# Altium schematic sheet STM32405RG.SchDoc
size A
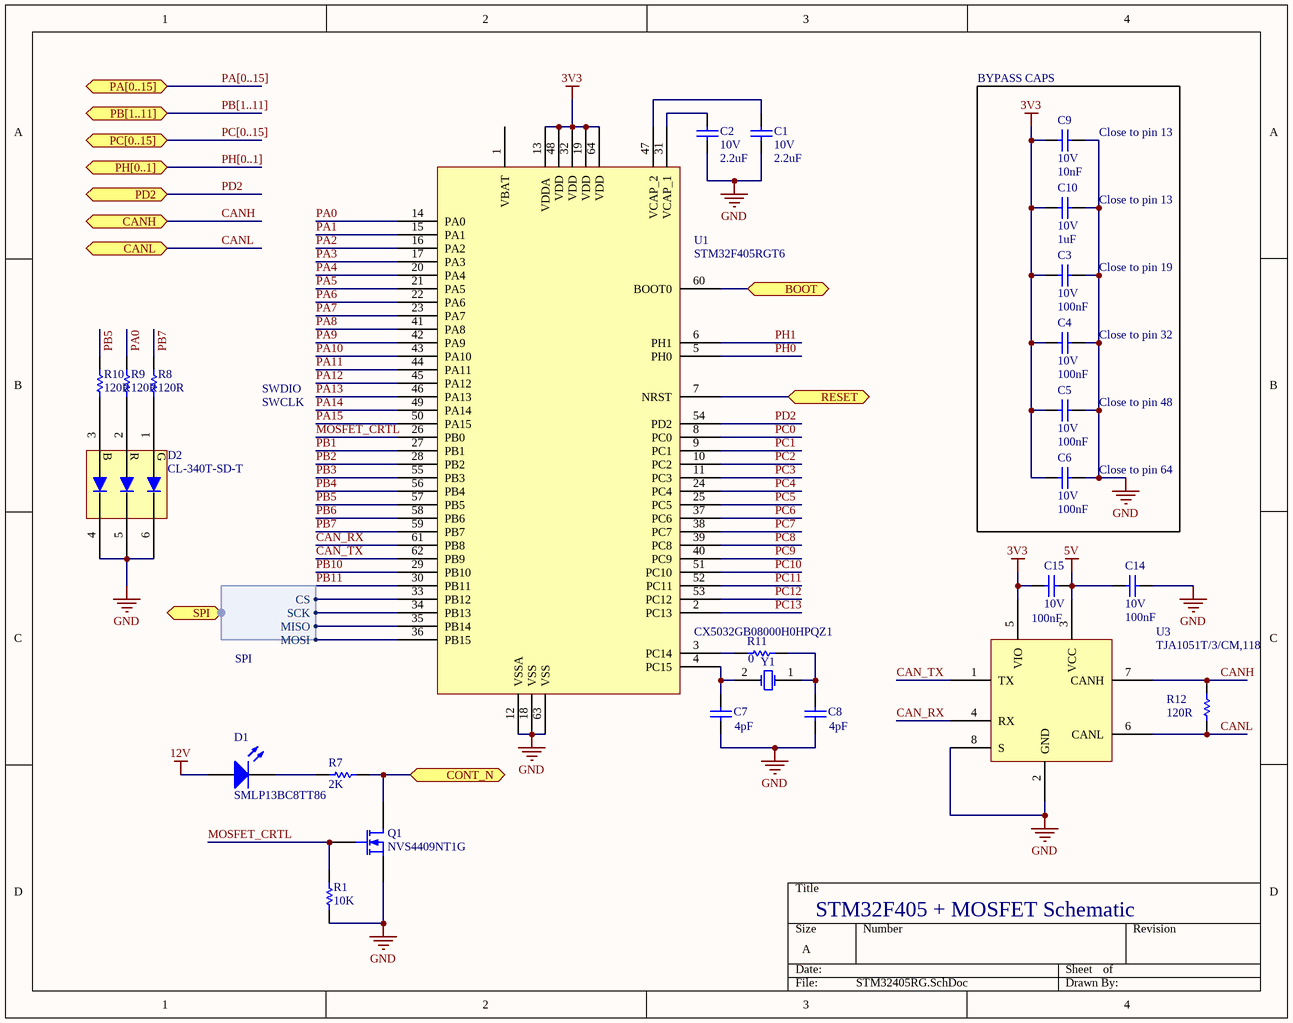
[diagram p0: STM32405RG.SchDoc]

## Parts
C1  10V  value 2.2uF  [C0805]
C2  10V  value 2.2uF  [C0805]
C3  10V  value 100nF  [C0805]
C4  10V  value 100nF  [C0805]
C5  10V  value 100nF  [C0805]
C6  10V  value 100nF  [C0805]
C7  value 4pF  [C0805]  (hidden comment: 50V)
C8  value 4pF  [C0805]  (hidden comment: 50V)
C9  10V  value 10nF  [C0805]
C10  10V  value 1uF  [C0805]
C14  10V  value 100nF  [C0805]
C15  10V  value 100nF  [C0805]
D1  SMLP13BC8TT86  [SMLP13BC8TT86]
D2  CL-340T-SD-T  [CL-340T-SD-T]
Q1  NVS4409NT1G  [NVS4409NT1G]
R1  value 10K  [J1-0603]  (hidden comment: 5%)
R7  value 2K  [J1-0603]  (hidden comment: 5%)
R8  value 120R  [J1-0603]  (hidden comment: 1%)
R9  value 120R  [J1-0603]  (hidden comment: 1%)
R10  value 120R  [J1-0603]  (hidden comment: 1%)
R11  value 0  [J1-0603]  (hidden comment: 0603)
R12  value 120R  [J1-0603]  (hidden comment: 1%)
U1  STM32F405RGT6  [STM32F405RGT6TR]
U3  TJA1051T/3/CM,118
Y1  CX5032GB08000H0HPQZ1  [CX5032GB08000H0HPQZ1]

## Ports
BOOT (bidir), CANH (bidir), CANL (bidir), CONT_N (bidir), PA[0..15] (bidir), PB[1..11] (bidir), PC[0..15] (bidir), PD2 (bidir), PH[0..1] (bidir), RESET (bidir), SPI (bidir, harness SPI)

## Harnesses
SPI: CS, SCK, MISO, MOSI

## Nets
3V3: C3.1 C4.1 C5.1 C6.1 C9.1 C10.2 C15.1 U1.13(VDDA) U1.19(VDD) U1.32(VDD) U1.48(VDD) U1.64(VDD) U3.5(VIO)
5V: C14.1 C15.2 U3.3(VCC)
12V: D1.1(A)
GND: C1.1 C2.1 C3.2 C4.2 C5.2 C6.2 C7.1 C8.1 C9.2 C10.1 C14.2 D2.4 D2.5 D2.6 Q1.3(S) R1.1 U1.12(VSSA) U1.18(VSS) U1.63(VSS) U3.2(GND) U3.8(S)
BOOT: U1.60(BOOT0) ; port BOOT
CAN_RX: U1.61(PB8) U3.4(RX)
CAN_TX: U1.62(PB9) U3.1(TX)
CANH: R12.2 U3.7(CANH) ; port CANH
CANL: R12.1 U3.6(CANL) ; port CANL
CONT_N: Q1.1(D) R7.1 ; port CONT_N
MOSFET_CRTL: Q1.2(G) R1.2 U1.26(PB0)
PA0: R9.2 U1.14(PA0)
PA1: U1.15(PA1)
PA2: U1.16(PA2)
PA3: U1.17(PA3)
PA4: U1.20(PA4)
PA5: U1.21(PA5)
PA6: U1.22(PA6)
PA7: U1.23(PA7)
PA8: U1.41(PA8)
PA9: U1.42(PA9)
PA10: U1.43(PA10)
PA11: U1.44(PA11)
PA12: U1.45(PA12)
PA13: U1.46(PA13)
PA14: U1.49(PA14)
PA15: U1.50(PA15)
PB1: U1.27(PB1)
PB2: U1.28(PB2)
PB3: U1.55(PB3)
PB4: U1.56(PB4)
PB5: R10.2 U1.57(PB5)
PB6: U1.58(PB6)
PB7: R8.2 U1.59(PB7)
PB10: U1.29(PB10)
PB11: U1.30(PB11)
PC0: U1.8(PC0)
PC1: U1.9(PC1)
PC2: U1.10(PC2)
PC3: U1.11(PC3)
PC4: U1.24(PC4)
PC5: U1.25(PC5)
PC6: U1.37(PC6)
PC7: U1.38(PC7)
PC8: U1.39(PC8)
PC9: U1.40(PC9)
PC10: U1.51(PC10)
PC11: U1.52(PC11)
PC12: U1.53(PC12)
PC13: U1.2(PC13)
PD2: U1.54(PD2) ; port PD2
PH0: U1.5(PH0)
PH1: U1.6(PH1)
RESET: U1.7(NRST) ; port RESET
NetC1_2: C1.2 U1.47(VCAP_2)
NetC2_2: C2.2 U1.31(VCAP_1)
NetC7_2: C7.2 U1.4(PC15) Y1.2(OSC2)
NetC8_2: C8.2 R11.2 Y1.1(OSC1)
NetD1_2: D1.2(K) R7.2
NetD2_1: D2.1 R8.1
NetD2_2: D2.2 R9.1
NetD2_3: D2.3 R10.1
NetR11_1: R11.1 U1.3(PC14)
NetU1_33: U1.33(PB12) ; port SPI.CS
NetU1_34: U1.34(PB13) ; port SPI.SCK
NetU1_35: U1.35(PB14) ; port SPI.MISO
NetU1_36: U1.36(PB15) ; port SPI.MOSI

Not connected (* = marked no-connect by the designer): U1 1(VBAT)

## Buses and harness runs
bus PA[0..15] = port PA[0..15]
bus PB[1..11] = port PB[1..11]
bus PC[0..15] = port PC[0..15]
bus PH[0..1] = port PH[0..1]

## Notes on the sheet
- BYPASS CAPS
- (near C9) Close to pin 13
- (near C10) Close to pin 13
- (near C3) Close to pin 19
- (near C4) Close to pin 32
- SWCLK
- SWDIO
- (near C5) Close to pin 48
- (near C6) Close to pin 64
- STM32F405 + MOSFET Schematic
- (in symbol CL-340T-SD-T) B; R; G

## Library data of the parts
C1 C2 = Cap: C0805C225K8RACAUTO. 2.2µF ±10% 10V Ceramic Capacitor X7R 0805 (2012 Metric) /; Published: 8-Jun-2000; LatestRevisionDate: 17-Jul-2002; LatestRevisionNote: Re-released for DXP Platform.; PackageReference: RAD-0.3; Publisher: Altium Limited; PackageDescription: Radial Cap, Thru-Hole; 2 Leads; 0.3 in Pin Spacing
C3-C6 C14 C15 = Cap: C0805C104K8RACTU. 0.1µF ±10% 10V Ceramic Capacitor X7R 0805 (2012 Metric) /; Published: 8-Jun-2000; LatestRevisionDate: 17-Jul-2002; LatestRevisionNote: Re-released for DXP Platform.; PackageReference: RAD-0.3; Publisher: Altium Limited; PackageDescription: Radial Cap, Thru-Hole; 2 Leads; 0.3 in Pin Spacing
C7 = Cap: CBR08C409B5GAC. 4pF ±0.1pF 50V Ceramic Capacitor C0G, NP0 0805 (2012 Metric); Published: 8-Jun-2000; LatestRevisionDate: 17-Jul-2002; LatestRevisionNote: Re-released for DXP Platform.; PackageReference: RAD-0.3; Publisher: Altium Limited; PackageDescription: Radial Cap, Thru-Hole; 2 Leads; 0.3 in Pin Spacing
C8 = Cap: CBR08C409B5GAC; Published: 8-Jun-2000; LatestRevisionDate: 17-Jul-2002; LatestRevisionNote: Re-released for DXP Platform.; PackageReference: RAD-0.3; Publisher: Altium Limited; PackageDescription: Radial Cap, Thru-Hole; 2 Leads; 0.3 in Pin Spacing
C9 = Cap: C0805C103K8RAC7800. 10000pF ±10% 10V Ceramic Capacitor X7R 0805 (2012 Metric) /; Published: 8-Jun-2000; LatestRevisionDate: 17-Jul-2002; LatestRevisionNote: Re-released for DXP Platform.; PackageReference: RAD-0.3; Publisher: Altium Limited; PackageDescription: Radial Cap, Thru-Hole; 2 Leads; 0.3 in Pin Spacing
C10 = Cap: CL21B105KPFNNNE. 1µF ±10% 10V Ceramic Capacitor X7R 0805 (2012 Metric) /; Published: 8-Jun-2000; LatestRevisionDate: 17-Jul-2002; LatestRevisionNote: Re-released for DXP Platform.; PackageReference: RAD-0.3; Publisher: Altium Limited; PackageDescription: Radial Cap, Thru-Hole; 2 Leads; 0.3 in Pin Spacing
D1 = LED2: Blue 470nm LED Indication - Discrete 2.9V 2-SMD, No Lead; Published: 8-Jun-2000; LatestRevisionDate: 17-Jul-2002; LatestRevisionNote: Re-released for DXP Platform.; PackageVersion: Feb-2002; PackageReference: 3.2X1.6X1.1; Publisher: Altium Limited; PackageDescription: SM LED; 2 Flat Leads
Q1 = MOSFET-N: N-Channel 25V 700mA (Ta) 280mW (Tj) Surface Mount SC-70-3 (SOT323); Published: 8-Jun-2000; LatestRevisionDate: 17-Jul-2002; LatestRevisionNote: Re-released for DXP Platform.; PackageVersion: 1995/1996; PackageReference: E3; Publisher: Altium Limited; PackageDescription: TO, Flat Index; 3 In-Line, Axial Leads; Body Dia. 4.6mm; Lead Dia. 0.5 mm (max)
R1 = Res1: ERJ-3GEYJ103V. 10 kOhms ±5% 0.1W, 1/10W Chip Resistor 0603 (1608 Metric) Automotive AEC-Q200 Thick Film /; Published: 8-Jun-2000; LatestRevisionDate: 17-Jul-2002; LatestRevisionNote: Re-released for DXP Platform.; PackageReference: AXIAL-0.3; Publisher: Altium Limited; PackageDescription: Axial Device, Thru-Hole; 2 Leads; 0.3 in Pin Spacing
R7 = Res1: ERJ-PA3J202V. 2 kOhms ±5% 0.25W, 1/4W Chip Resistor 0603 (1608 Metric) Automotive AEC-Q200, Pulse Withstanding Thick Film /; Published: 8-Jun-2000; LatestRevisionDate: 17-Jul-2002; LatestRevisionNote: Re-released for DXP Platform.; PackageReference: AXIAL-0.3; Publisher: Altium Limited; PackageDescription: Axial Device, Thru-Hole; 2 Leads; 0.3 in Pin Spacing
R8-R10 R12 = Res1: RC0603FR-07120RL. 120 Ohms ±1% 0.1W, 1/10W Chip Resistor 0603 (1608 Metric) Moisture Resistant Thick Film /; Published: 8-Jun-2000; LatestRevisionDate: 17-Jul-2002; LatestRevisionNote: Re-released for DXP Platform.; PackageReference: AXIAL-0.3; Publisher: Altium Limited; PackageDescription: Axial Device, Thru-Hole; 2 Leads; 0.3 in Pin Spacing
R11 = Res1: ERJ-U030R00V. 0 Ohms Jumper 0.1W, 1/10W Chip Resistor 0603 (1608 Metric) Anti-Sulfur, Automotive AEC-Q200 Thick Film; Published: 8-Jun-2000; LatestRevisionDate: 17-Jul-2002; LatestRevisionNote: Re-released for DXP Platform.; PackageReference: AXIAL-0.3; Publisher: Altium Limited; PackageDescription: Axial Device, Thru-Hole; 2 Leads; 0.3 in Pin Spacing
U1 = STM32F405RGT6TR
U3 = TJA1050T/CM,118
Y1 = XTAL: 8MHz ±20ppm Crystal 12pF 300 Ohms 2-SMD, No Lead /; Published: 8-Jun-2000; LatestRevisionDate: 17-Jul-2002; LatestRevisionNote: Re-released for DXP Platform.; PackageReference: R38; Publisher: Altium Limited; PackageDescription: Crystal, Thru-Hole; 2 Leads; Body 3.1 x 8.2 mm (Dia.xH)